# Altium project WPU161C_PCB.PrjPcb
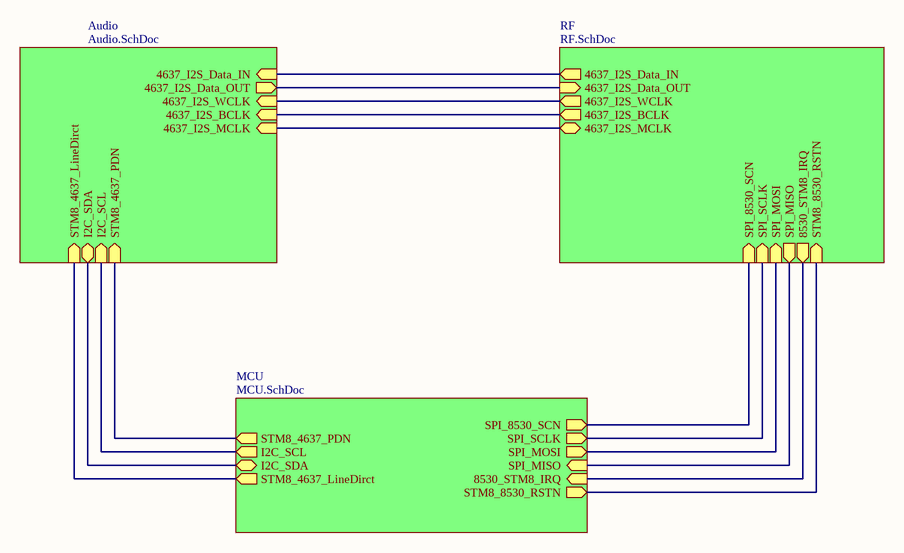
[diagram p0: TopLevel.SchDoc]
4 sheets, 97 parts. Net scope: hierarchical (ports join the sheet entries above them; power ports are global).
Board file: AirTone-MLL.PcbDoc
Sheets:
  TopLevel.SchDoc
    MCU = MCU.SchDoc
    RF = RF.SchDoc
    Audio = Audio.SchDoc

## Sheet TopLevel.SchDoc
size A4

### Sub-sheets
Audio = Audio.SchDoc: 4637_I2S_Data_IN (in), 4637_I2S_Data_OUT (out), 4637_I2S_WCLK (in), 4637_I2S_BCLK (in), 4637_I2S_MCLK (in), STM8_4637_PDN (in), I2C_SCL (in), I2C_SDA (bidir), STM8_4637_LineDirct (in)
MCU = MCU.SchDoc: STM8_4637_PDN (out), I2C_SCL (out), I2C_SDA (bidir), STM8_4637_LineDirct (out), SPI_8530_SCN (out), SPI_SCLK (out), SPI_MOSI (out), SPI_MISO (in), 8530_STM8_IRQ (in), STM8_8530_RSTN (out)
RF = RF.SchDoc: 4637_I2S_Data_IN (out), 4637_I2S_Data_OUT (in), 4637_I2S_WCLK (out), 4637_I2S_BCLK (out), 4637_I2S_MCLK, SPI_8530_SCN (in), SPI_SCLK (in), SPI_MOSI (in), SPI_MISO (out), 8530_STM8_IRQ (out), STM8_8530_RSTN (in)

### Nets
8530_CSN: sheet MCU/SPI_8530_SCN, sheet RF/SPI_8530_SCN
8530_MISO: sheet MCU/SPI_MISO, sheet RF/SPI_MISO
8530_MOSI: sheet MCU/SPI_MOSI, sheet RF/SPI_MOSI
8530_RSTN: sheet MCU/STM8_8530_RSTN, sheet RF/STM8_8530_RSTN
8530_SCLK: sheet MCU/SPI_SCLK, sheet RF/SPI_SCLK
NetADG849_1: sheet MCU/STM8_4637_LineDirct, sheet Audio/STM8_4637_LineDirct
NetAK4637EN_2: sheet MCU/STM8_4637_PDN, sheet Audio/STM8_4637_PDN
NetAK4637EN_3: sheet MCU/I2C_SCL, sheet Audio/I2C_SCL
NetAK4637EN_4: sheet MCU/I2C_SDA, sheet Audio/I2C_SDA
NetAK4637EN_5: sheet RF/4637_I2S_Data_IN, sheet Audio/4637_I2S_Data_IN
NetAK4637EN_6: sheet RF/4637_I2S_Data_OUT, sheet Audio/4637_I2S_Data_OUT
NetAK4637EN_7: sheet RF/4637_I2S_WCLK, sheet Audio/4637_I2S_WCLK
NetAK4637EN_8: sheet RF/4637_I2S_BCLK, sheet Audio/4637_I2S_BCLK
NetAK4637EN_9: sheet RF/4637_I2S_MCLK, sheet Audio/4637_I2S_MCLK
NetCC8530_7: sheet MCU/8530_STM8_IRQ, sheet RF/8530_STM8_IRQ

## Sheet MCU.SchDoc
size B
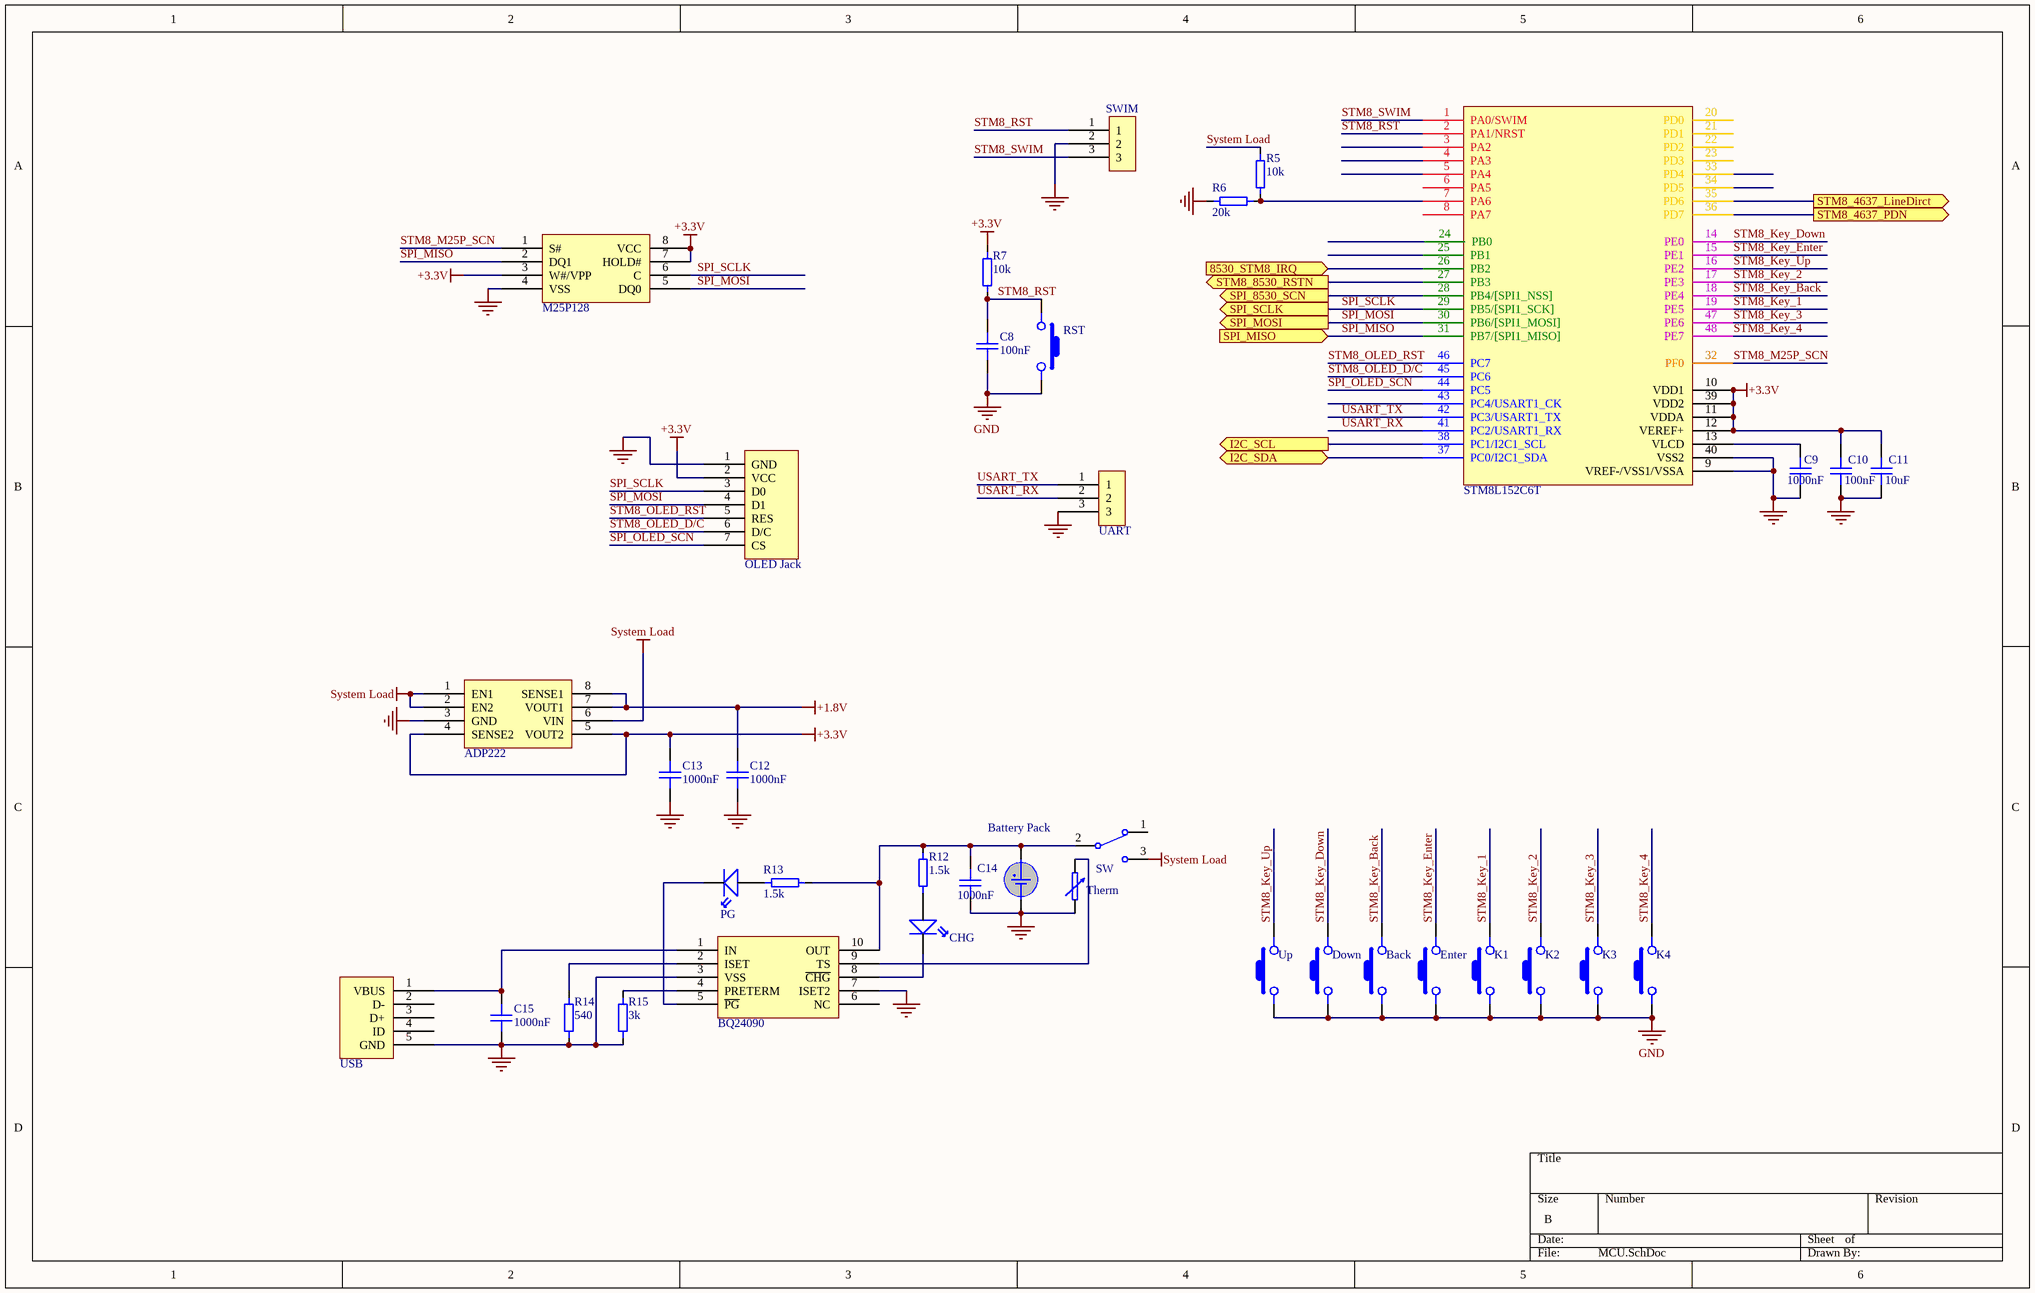
[diagram p1: MCU.SchDoc]

### Parts
ADP222  ADP222ACPZ-1833-R7  [ADP22x]  (value not drawn)
Back  Button  [Button_3x4]  (value not drawn)
Battery_Pack  Battery Pack  [Battery Jack small]  (value not drawn)
BQ24090  BQ24090  [BQ24090]  (value not drawn)
C8  value 100nF  [SMD 0402]  (hidden comment: Capacity SMD)
C9  value 1000nF  [SMD 0402]  (hidden comment: Capacity SMD)
C10  value 100nF  [SMD 0402]  (hidden comment: Capacity SMD)
C11  value 10uF  [SMD 0402]  (hidden comment: Capacity SMD)
C12  value 1000nF  [SMD 0402]  (hidden comment: Capacity SMD)
C13  value 1000nF  [SMD 0402]  (hidden comment: Capacity SMD)
C14  value 1000nF  [SMD 0402]  (hidden comment: Capacity SMD)
C15  value 1000nF  [SMD 0402_silk]  (hidden comment: Capacity SMD)
CHG  LED  [LED_0603]  (value not drawn)
Down  Button  [Button_3x4]  (value not drawn)
Enter  Button  [Button_3x4]  (value not drawn)
K1  Button  [Button_3x4]  (value not drawn)
K2  Button  [Button_3x4]  (value not drawn)
K3  Button  [Button_3x4]  (value not drawn)
K4  Button  [Button_3x4]  (value not drawn)
M25P128  M25P128  [M25P128]  (value not drawn)
OLED_Jack  OLED Jack  [OLED Jack]  (value not drawn)
PG  LED  [LED_0603]  (value not drawn)
R5  value 10k  [SMD 0402]  (hidden comment: Resistor SMD)
R6  value 20k  [SMD 0402]  (hidden comment: Resistor SMD)
R7  value 10k  [SMD 0402]  (hidden comment: Resistor SMD)
R12  value 1.5k  [SMD 0402]  (hidden comment: Resistor SMD)
R13  value 1.5k  [SMD 0402]  (hidden comment: Resistor SMD)
R14  value 540  [SMD 0402]  (hidden comment: Resistor SMD)
R15  value 3k  [SMD 0402]  (hidden comment: Resistor SMD)
RST  Button  [Button_3x4]  (value not drawn)
STM8L152C6T  STM8L152C6T  [STM LQFP48]  (value not drawn)
SW  Switch  [Switch 2P2T]  (value not drawn)
SWIM  Header_3x1  [HEADER_3x1_2.54]  (value not drawn)
Therm  Thermistor  [Header_2x1_2.00]  (value not drawn)
UART  Header_3x1  [HEADER_3x1_2.54]  (value not drawn)
Up  Button  [Button_3x4]  (value not drawn)
USB  USB Jack Mirco-B  [USB Micro-B]  (value not drawn)

### Ports
8530_STM8_IRQ (in), I2C_SCL (out), I2C_SDA (bidir), SPI_8530_SCN (out), SPI_MISO (in), SPI_MOSI (out), SPI_SCLK (out), STM8_4637_LineDirct (out), STM8_4637_PDN (out), STM8_8530_RSTN (out)

### Nets
+1.8V: ADP222.7(VOUT1) ADP222.8(SENSE1) C12.1
+3.3V: ADP222.4(SENSE2) ADP222.5(VOUT2) C10.2 C11.2 C13.2 M25P128.3(W#/VPP) M25P128.7(HOLD#) M25P128.8(VCC) OLED_Jack.2(VCC) R7.2 STM8L152C6T.10(VDD1) STM8L152C6T.11(VDDA) STM8L152C6T.12(VEREF+) STM8L152C6T.39(VDD2)
GND: ADP222.3(GND) Back.2 Battery_Pack.2 BQ24090.3(VSS) BQ24090.7(ISET2) C8.1 C9.1 C10.1 C11.1 C12.2 C13.1 C14.1 C15.1 Down.2 Enter.2 K1.2 K2.2 K3.2 K4.2 M25P128.4(VSS) OLED_Jack.1(GND) R6.1 R14.1 R15.1 RST.1 STM8L152C6T.9(VREF-/VSS1/VSSA) STM8L152C6T.40(VSS2) SWIM.2 Therm.2 UART.3 Up.2 USB.5(GND)
System Load: ADP222.1(EN1) ADP222.2(EN2) ADP222.6(VIN) R5.2 SW.3
8530_CSN: STM8L152C6T.28(PB4/[SPI1_NSS]) ; port SPI_8530_SCN
8530_RSTN: STM8L152C6T.27(PB3) ; port STM8_8530_RSTN
SPI_MISO: M25P128.2(DQ1) STM8L152C6T.31(PB7/[SPI1_MISO]) ; port SPI_MISO  [project net 8530_MISO]
SPI_MOSI: M25P128.5(DQ0) OLED_Jack.4(D1) STM8L152C6T.30(PB6/[SPI1_MOSI]) ; port SPI_MOSI  [project net 8530_MOSI]
SPI_OLED_SCN: OLED_Jack.7(CS) STM8L152C6T.44(PC5)
SPI_SCLK: M25P128.6(C) OLED_Jack.3(D0) STM8L152C6T.29(PB5/[SPI1_SCK]) ; port SPI_SCLK  [project net 8530_SCLK]
STM8_Key_1: K1.1 STM8L152C6T.19(PE5)
STM8_Key_2: K2.1 STM8L152C6T.17(PE3)
STM8_Key_3: K3.1 STM8L152C6T.47(PE6)
STM8_Key_4: K4.1 STM8L152C6T.48(PE7)
STM8_Key_Back: Back.1 STM8L152C6T.18(PE4)
STM8_Key_Down: Down.1 STM8L152C6T.14(PE0)
STM8_Key_Enter: Enter.1 STM8L152C6T.15(PE1)
STM8_Key_Up: STM8L152C6T.16(PE2) Up.1
STM8_M25P_SCN: M25P128.1(S#) STM8L152C6T.32(PF0)
STM8_OLED_D/C: OLED_Jack.6(D/C) STM8L152C6T.45(PC6)
STM8_OLED_RST: OLED_Jack.5(RES) STM8L152C6T.46(PC7)
STM8_RST: C8.2 R7.1 RST.2 STM8L152C6T.2(PA1/NRST) SWIM.1
STM8_SWIM: STM8L152C6T.1(PA0/SWIM) SWIM.3
USART_RX: STM8L152C6T.41(PC2/USART1_RX) UART.2
USART_TX: STM8L152C6T.42(PC3/USART1_TX) UART.1
NetADG849_1: STM8L152C6T.35(PD6) ; port STM8_4637_LineDirct
NetAK4637EN_2: STM8L152C6T.36(PD7) ; port STM8_4637_PDN
NetAK4637EN_3: STM8L152C6T.38(PC1/I2C1_SCL) ; port I2C_SCL
NetAK4637EN_4: STM8L152C6T.37(PC0/I2C1_SDA) ; port I2C_SDA
NetBattery_Pack_1: Battery_Pack.1 BQ24090.10(OUT) C14.2 R12.2 R13.2 SW.2
NetBQ24090_1: BQ24090.1(IN) C15.2 USB.1(VBUS)
NetBQ24090_2: BQ24090.2(ISET) R14.2
NetBQ24090_4: BQ24090.4(PRETERM) R15.2
NetBQ24090_5: BQ24090.5(~{PG}) PG.2
NetBQ24090_8: BQ24090.8(~{CHG}) CHG.2
NetBQ24090_9: BQ24090.9(TS) Therm.1
NetC9_2: C9.2 STM8L152C6T.13(VLCD)
NetCC8530_7: STM8L152C6T.26(PB2) ; port 8530_STM8_IRQ
NetCHG_1: CHG.1 R12.1
NetPG_1: PG.1 R13.1
NetR5_1: R5.1 R6.2 STM8L152C6T.7(PA6)

Not connected (* = marked no-connect by the designer): BQ24090 6(NC); STM8L152C6T 3(PA2) 4(PA3) 5(PA4) 6(PA5) 8(PA7) 20(PD0) 21(PD1) 22(PD2) 23(PD3) 24(PB0) 25(PB1) 33(PD4) 34(PD5) 43(PC4/USART1_CK); SW 1; USB 2(D-) 3(D+) 4(ID)

### Library data of the parts
ADP222 = ADP222: FootPrint: 8-Pin LFCSP
Therm = Thermistor NTC: Value: 10k; type: NTC
USB = USB Jack Micro-B
Battery_Pack = Battery Pack: FootPrint: 2.54mm
BQ24090 = BQ24090: FootPrint: 10-Pin MSOP
M25P128 = M25P128: FootPrint: VFDFPN8
OLED_Jack = OLED Jack: FootPrint: header 7x1 2.54mm
STM8L152C6T = STM8L152C6T: FootPrint: 48-Pin LQPF

## Sheet RF.SchDoc
size A4
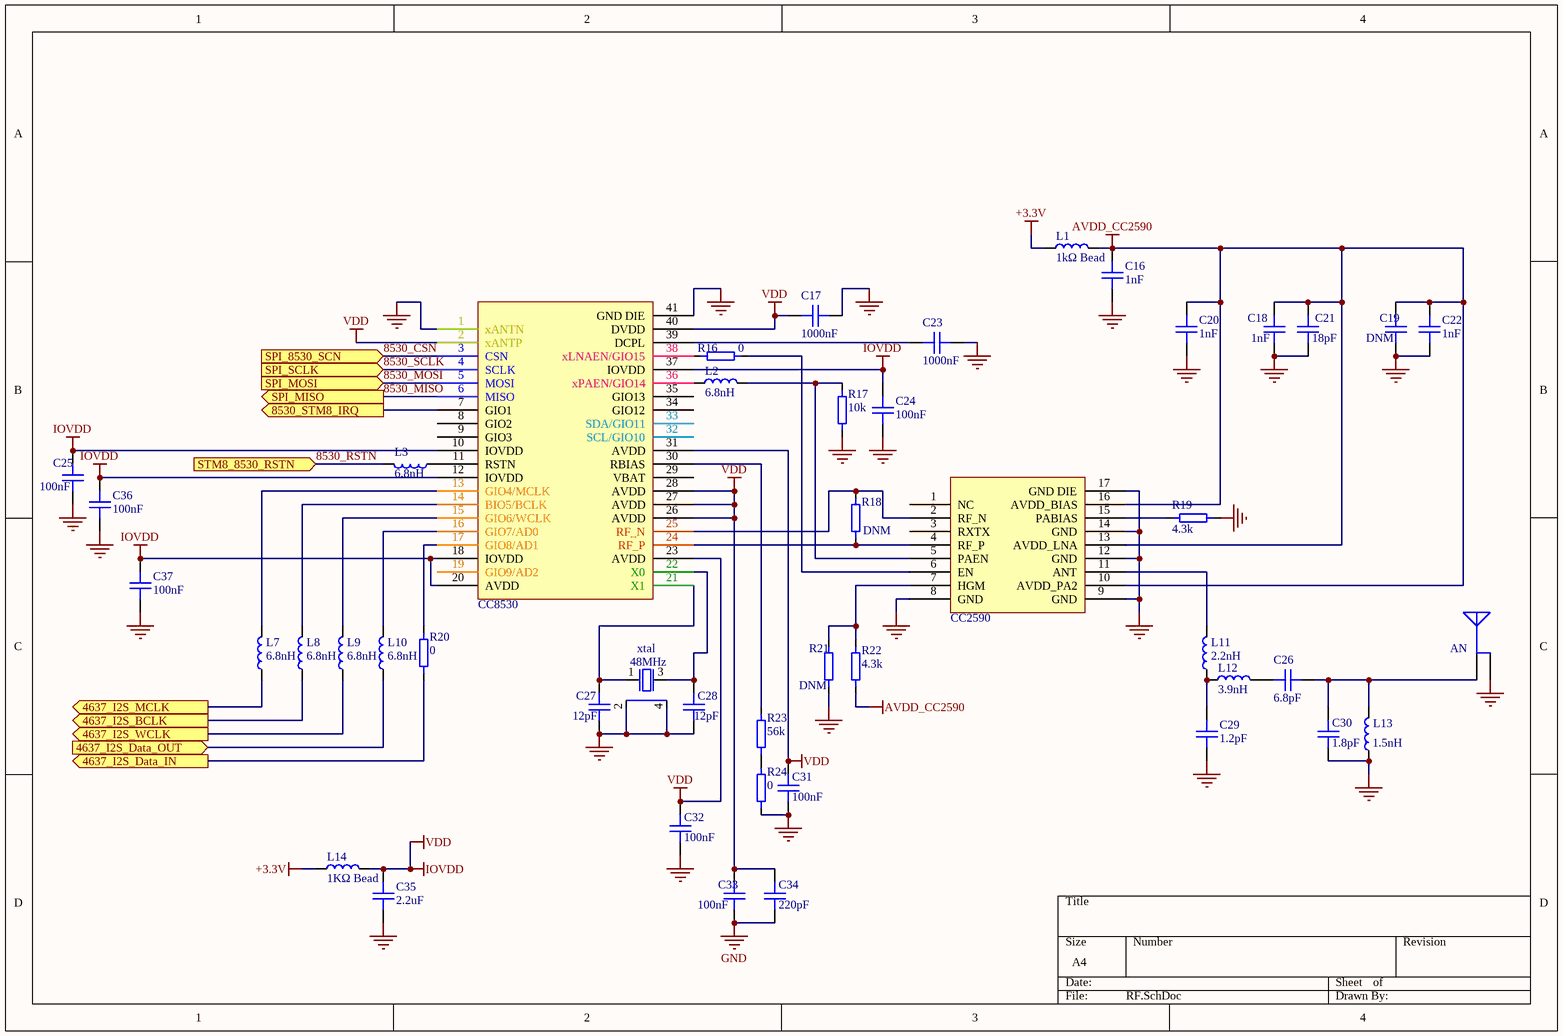
[diagram p2: RF.SchDoc]

### Parts
AN  Antenna  [ANT_WIGGLE_1MM]  (value not drawn)
C16  value 1nF  [SMD 0402]  (hidden comment: Capacity SMD)
C17  value 1000nF  [SMD 0402]  (hidden comment: Capacity SMD)
C18  value 1nF  [SMD 0402]  (hidden comment: Capacity SMD)
C19  value DNM  [SMD 0402]  (hidden comment: Capacity SMD)
C20  value 1nF  [SMD 0402]  (hidden comment: Capacity SMD)
C21  value 18pF  [SMD 0402]  (hidden comment: Capacity SMD)
C22  value 1nF  [SMD 0402]  (hidden comment: Capacity SMD)
C23  value 1000nF  [SMD 0402]  (hidden comment: Capacity SMD)
C24  value 100nF  [SMD 0402]  (hidden comment: Capacity SMD)
C25  value 100nF  [SMD 0402]  (hidden comment: Capacity SMD)
C26  value 6.8pF  [SMD 0402]  (hidden comment: Capacity SMD)
C27  value 12pF  [SMD 0402]  (hidden comment: Capacity SMD)
C28  value 12pF  [SMD 0402]  (hidden comment: Capacity SMD)
C29  value 1.2pF  [SMD 0402]  (hidden comment: Capacity SMD)
C30  value 1.8pF  [SMD 0402]  (hidden comment: Capacity SMD)
C31  value 100nF  [SMD 0402]  (hidden comment: Capacity SMD)
C32  value 100nF  [SMD 0402]  (hidden comment: Capacity SMD)
C33  value 100nF  [SMD 0402]  (hidden comment: Capacity SMD)
C34  value 220pF  [SMD 0402]  (hidden comment: Capacity SMD)
C35  value 2.2uF  [SMD 0402]  (hidden comment: Capacity SMD)
C36  value 100nF  [SMD 0402]  (hidden comment: Capacity SMD)
C37  value 100nF  [SMD 0402]  (hidden comment: Capacity SMD)
CC2590  CC2590  [CC2590]  (value not drawn)
CC8530  CC8530  [CC8530]  (value not drawn)
L1  value 1kΩ Bead  [SMD 0402]  (hidden comment: Inductor SMD)
L2  value 6.8nH  [SMD 0402]  (hidden comment: Inductor SMD)
L3  value 6.8nH  [SMD 0402]  (hidden comment: Inductor SMD)
L7  value 6.8nH  [SMD 0402]  (hidden comment: Inductor SMD)
L8  value 6.8nH  [SMD 0402]  (hidden comment: Inductor SMD)
L9  value 6.8nH  [SMD 0402]  (hidden comment: Inductor SMD)
L10  value 6.8nH  [SMD 0402]  (hidden comment: Inductor SMD)
L11  value 2.2nH  [SMD 0402]  (hidden comment: Inductor SMD)
L12  value 3.9nH  [SMD 0402]  (hidden comment: Inductor SMD)
L13  value 1.5nH  [SMD 0402]  (hidden comment: Inductor SMD)
L14  value 1KΩ Bead  [SMD 0402]  (hidden comment: Inductor SMD)
R16  value 0  [SMD 0402]  (hidden comment: Resistor SMD)
R17  value 10k  [SMD 0402]  (hidden comment: Resistor SMD)
R18  value DNM  [SMD 0402]  (hidden comment: Resistor SMD)
R19  value 4.3k  [SMD 0402]  (hidden comment: Resistor SMD)
R20  value 0  [SMD 0402]  (hidden comment: Resistor SMD)
R21  value DNM  [SMD 0402]  (hidden comment: Resistor SMD)
R22  value 4.3k  [SMD 0402]  (hidden comment: Resistor SMD)
R23  value 56k  [SMD 0402]  (hidden comment: Resistor SMD)
R24  value 0  [SMD 0402]  (hidden comment: Resistor SMD)
xtal  value 48MHz  [xtal_3225_FA-128]  (hidden comment: XTAL)

### Ports
4637_I2S_BCLK (out), 4637_I2S_Data_IN (out), 4637_I2S_Data_OUT (in), 4637_I2S_MCLK (out), 4637_I2S_WCLK (out), 8530_STM8_IRQ (out), SPI_8530_SCN (in), SPI_MISO (out), SPI_MOSI (in), SPI_SCLK (in), STM8_8530_RSTN (in)

### Nets
+3.3V: L1.1 L14.1
AVDD_CC2590: C16.2 C18.2 C19.2 C20.2 C21.2 C22.2 CC2590.10(AVDD_PA2) CC2590.13(AVDD_LNA) CC2590.16(AVDD_BIAS) L1.2 R22.1
GND: AN.2 C16.1 C17.2 C18.1 C19.1 C20.1 C21.1 C22.1 C23.2 C24.1 C25.1 C27.1 C28.1 C29.1 C30.1 C31.1 C32.1 C33.1 C34.1 C35.1 C36.1 C37.1 CC2590.8(GND) CC2590.9(GND) CC2590.12(GND) CC2590.14(GND) CC2590.17(GND_DIE) CC8530.1(xANTN) CC8530.41(GND_DIE) L13.1 R17.1 R19.2 R21.1 R24.1 xtal.2(GND) xtal.4(GND)
IOVDD: C17.1 C24.2 C25.2 C31.2 C32.2 C33.2 C34.2 C35.2 C36.2 C37.2 CC8530.2(xANTP) CC8530.10(IOVDD) CC8530.12(IOVDD) CC8530.18(IOVDD) CC8530.20(AVDD) CC8530.23(AVDD) CC8530.26(AVDD) CC8530.27(AVDD) CC8530.28(AVDD) CC8530.31(AVDD) CC8530.37(IOVDD) CC8530.40(DVDD) L14.2  [also labelled VDD]
8530_CSN: CC8530.3(CSN) ; port SPI_8530_SCN
8530_MISO: CC8530.6(MISO) ; port SPI_MISO
8530_MOSI: CC8530.5(MOSI) ; port SPI_MOSI
8530_RSTN: L3.2 ; port STM8_8530_RSTN
8530_SCLK: CC8530.4(SCLK) ; port SPI_SCLK
NetAK4637EN_5: R20.1 ; port 4637_I2S_Data_IN
NetAK4637EN_6: L10.1 ; port 4637_I2S_Data_OUT
NetAK4637EN_7: L9.1 ; port 4637_I2S_WCLK
NetAK4637EN_8: L8.1 ; port 4637_I2S_BCLK
NetAK4637EN_9: L7.1 ; port 4637_I2S_MCLK
NetAN_1: AN.1 C26.2 C30.2 L13.2
NetC23_1: C23.1 CC8530.39(DCPL)
NetC26_1: C26.1 L12.2
NetC27_2: C27.2 CC8530.21(X1) xtal.1(inp)
NetC28_2: C28.2 CC8530.22(X0) xtal.3(out)
NetC29_2: C29.2 L11.1 L12.1
NetCC2590_2: CC2590.2(RF_N) CC8530.25(RF_N) R18.2
NetCC2590_4: CC2590.4(RF_P) CC8530.24(RF_P) R18.1
NetCC2590_5: CC2590.5(PAEN) L2.2 R17.2
NetCC2590_6: CC2590.6(EN) R16.2
NetCC2590_7: CC2590.7(HGM) R21.2 R22.2
NetCC2590_11: CC2590.11(ANT) L11.2
NetCC2590_15: CC2590.15(PABIAS) R19.1
NetCC8530_7: CC8530.7(GIO1) ; port 8530_STM8_IRQ
NetCC8530_11: CC8530.11(RSTN) L3.1
NetCC8530_13: CC8530.13(GIO4/MCLK) L7.2
NetCC8530_14: CC8530.14(BIO5/BCLK) L8.2
NetCC8530_15: CC8530.15(GIO6/WCLK) L9.2
NetCC8530_16: CC8530.16(GIO7/AD0) L10.2
NetCC8530_17: CC8530.17(GIO8/AD1) R20.2
NetCC8530_30: CC8530.30(RBIAS) R23.2
NetCC8530_36: CC8530.36(xPAEN/GIO14) L2.1
NetCC8530_38: CC8530.38(xLNAEN/GIO15) R16.1
NetR23_1: R23.1 R24.2

Not connected (* = marked no-connect by the designer): CC2590 1(NC) 3(RXTX); CC8530 8(GIO2) 9(GIO3) 19(GIO9/AD2) 29(VBAT) 32(SCL/GIO10) 33(SDA/GIO11) 34(GIO12) 35(GIO13)

### Library data of the parts
xtal = XTAL: Part Number: FA-128, 48.00000MHz; Footprint: BT-XTAL_3225
CC2590 = CC2590: FootPrint: 16-Pin QFN
CC8530 = CC8530: FootPrint: 40-Pin QFN

## Sheet Audio.SchDoc
size A4
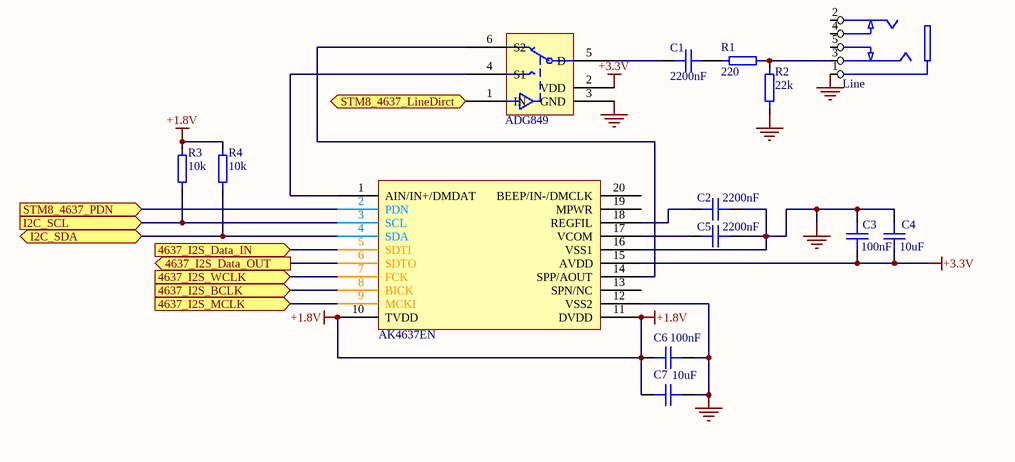
[diagram p3: Audio.SchDoc]

### Parts
ADG849  ADG849  [ADG849]  (value not drawn)
AK4637EN  AK4637EN  [AK4637EN]  (value not drawn)
C1  value 2200nF  [SMD 0402]  (hidden comment: Capacity SMD)
C2  value 2200nF  [SMD 0402]  (hidden comment: Capacity SMD)
C3  value 100nF  [SMD 0402]  (hidden comment: Capacity SMD)
C4  value 10uF  [SMD 0402]  (hidden comment: Capacity SMD)
C5  value 2200nF  [SMD 0402]  (hidden comment: Capacity SMD)
C6  value 100nF  [SMD 0402]  (hidden comment: Capacity SMD)
C7  value 10uF  [SMD 0402]  (hidden comment: Capacity SMD)
Line  Audio Jack  [Audio Jack PJ-328]  (value not drawn)
R1  value 220  [SMD 0402]  (hidden comment: Resistor SMD)
R2  value 22k  [SMD 0402]  (hidden comment: Resistor SMD)
R3  value 10k  [SMD 0402]  (hidden comment: Resistor SMD)
R4  value 10k  [SMD 0402]  (hidden comment: Resistor SMD)

### Ports
4637_I2S_BCLK (in), 4637_I2S_Data_IN (in), 4637_I2S_Data_OUT (out), 4637_I2S_MCLK (in), 4637_I2S_WCLK (in), I2C_SCL (in), I2C_SDA (bidir), STM8_4637_LineDirct (in), STM8_4637_PDN (in)

### Nets
+1.8V: AK4637EN.10(TVDD) AK4637EN.11(DVDD) C6.1 C7.1 R3.2 R4.2
+3.3V: ADG849.2(VDD) AK4637EN.15(AVDD) C3.1 C4.1
GND: ADG849.3(GND) AK4637EN.12(VSS2) AK4637EN.16(VSS1) C2.2 C3.2 C4.2 C5.2 C6.2 C7.2 Line.1(GND) R2.1
NetADG849_1: ADG849.1(IN) ; port STM8_4637_LineDirct
NetADG849_4: ADG849.4(S1) AK4637EN.1(AIN/IN+/DMDAT)
NetADG849_5: ADG849.5(D) C1.1
NetADG849_6: ADG849.6(S2) AK4637EN.14(SPP/AOUT)
NetAK4637EN_2: AK4637EN.2(PDN) ; port STM8_4637_PDN
NetAK4637EN_3: AK4637EN.3(SCL) R3.1 ; port I2C_SCL
NetAK4637EN_4: AK4637EN.4(SDA) R4.1 ; port I2C_SDA
NetAK4637EN_5: AK4637EN.5(SDTI) ; port 4637_I2S_Data_IN
NetAK4637EN_6: AK4637EN.6(SDTO) ; port 4637_I2S_Data_OUT
NetAK4637EN_7: AK4637EN.7(FCK) ; port 4637_I2S_WCLK
NetAK4637EN_8: AK4637EN.8(BICK) ; port 4637_I2S_BCLK
NetAK4637EN_9: AK4637EN.9(MCKI) ; port 4637_I2S_MCLK
NetAK4637EN_17: AK4637EN.17(VCOM) C5.1
NetAK4637EN_18: AK4637EN.18(REGFIL) C2.1
NetC1_2: C1.2 R1.1
NetLine_3: Line.3(LEFT) R1.2 R2.2

Not connected (* = marked no-connect by the designer): AK4637EN 13(SPN/NC) 19(MPWR) 20(BEEP/IN-/DMCLK); Line 2(RIGHT) 4(RIGHT_SW) 5(LEFT_SW)

### Library data of the parts
Line = Audio Jack PJ-328: Type: PJ-328
ADG849 = ADG849: FootPrint: 6-Pin SC70
AK4637EN = AK4637EN: FootPrint: 20-pin QFN

## Nets that join several sheets
+1.8V: MCU (ADP222.7 ADP222.8 C12.1), Audio (6 pins)
+3.3V: MCU (14 pins), RF (L1.1 L14.1), Audio (ADG849.2 AK4637EN.15 C3.1 C4.1)
GND: MCU (32 pins), RF (36 pins), Audio (11 pins)
8530_CSN: MCU (STM8L152C6T.28), RF (CC8530.3)
8530_MISO: MCU (M25P128.2 STM8L152C6T.31), RF (CC8530.6)
8530_MOSI: MCU (M25P128.5 OLED_Jack.4 STM8L152C6T.30), RF (CC8530.5)
8530_RSTN: MCU (STM8L152C6T.27), RF (L3.2)
8530_SCLK: MCU (M25P128.6 OLED_Jack.3 STM8L152C6T.29), RF (CC8530.4)
NetADG849_1: MCU (STM8L152C6T.35), Audio (ADG849.1)
NetAK4637EN_2: MCU (STM8L152C6T.36), Audio (AK4637EN.2)
NetAK4637EN_3: MCU (STM8L152C6T.38), Audio (AK4637EN.3 R3.1)
NetAK4637EN_4: MCU (STM8L152C6T.37), Audio (AK4637EN.4 R4.1)
NetAK4637EN_5: RF (R20.1), Audio (AK4637EN.5)
NetAK4637EN_6: RF (L10.1), Audio (AK4637EN.6)
NetAK4637EN_7: RF (L9.1), Audio (AK4637EN.7)
NetAK4637EN_8: RF (L8.1), Audio (AK4637EN.8)
NetAK4637EN_9: RF (L7.1), Audio (AK4637EN.9)
NetCC8530_7: MCU (STM8L152C6T.26), RF (CC8530.7)